# Altium schematic sheet Sheet1hh.SchDoc
size A4; SheetNumber: 1; SheetTotal: 1
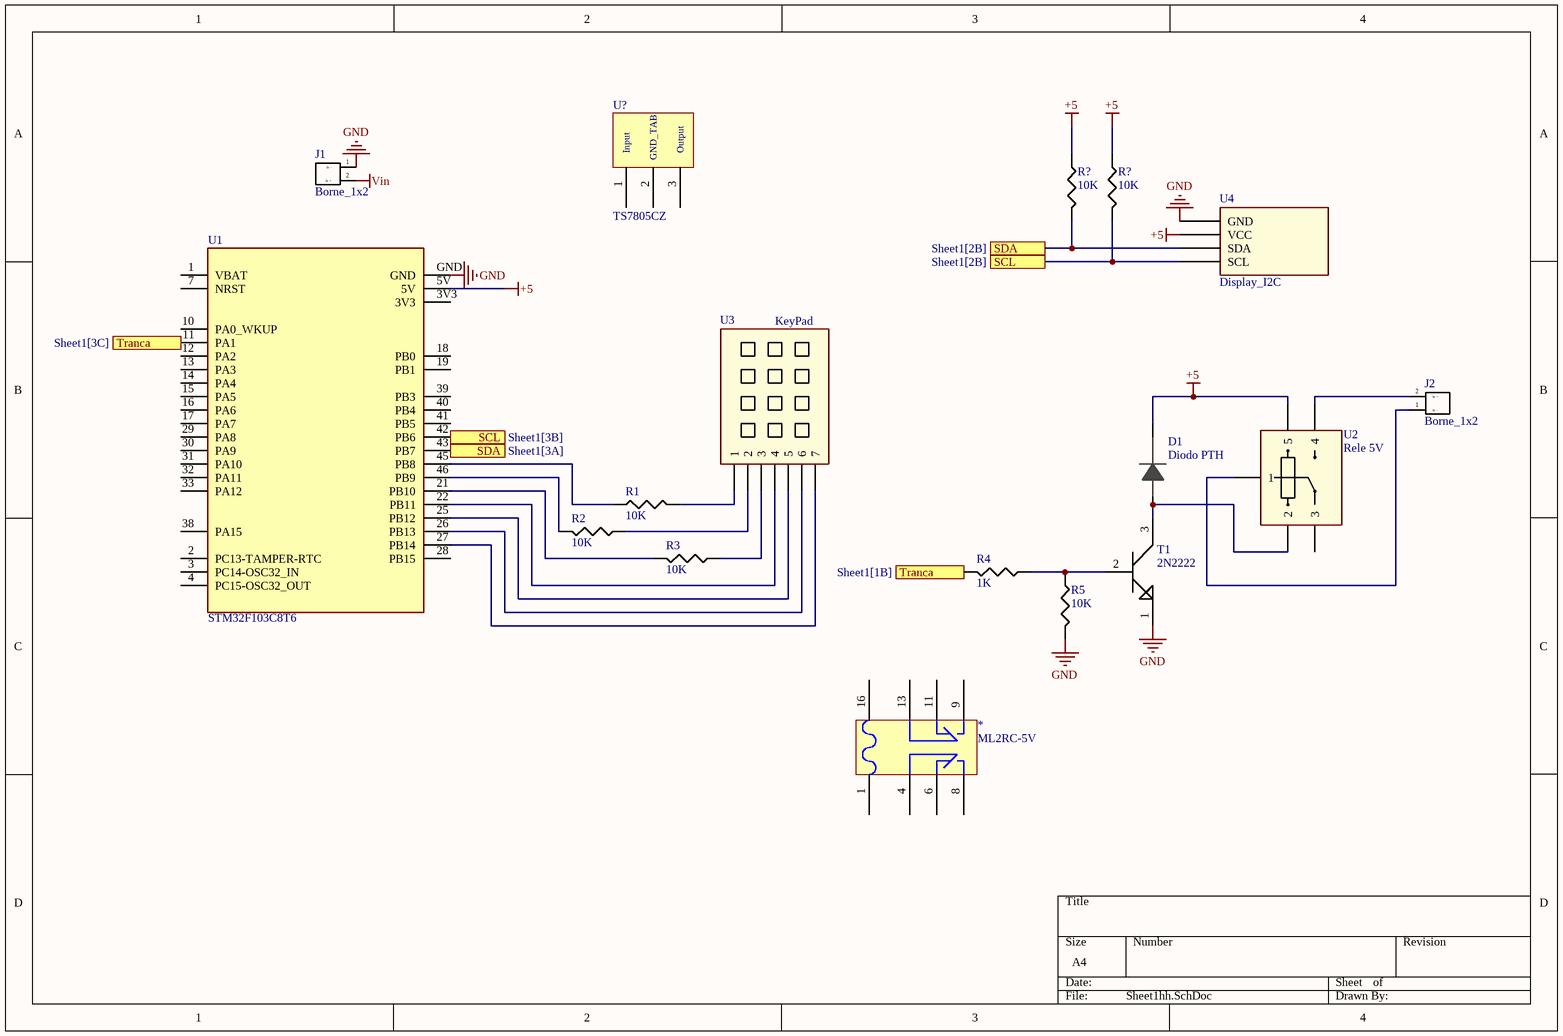
[diagram p0: Sheet1hh.SchDoc]

## Parts
(Parts that share a designator on the sheet are numbered #1, #2 ... from top to bottom, then left to right.)
*  ML2RC-5V  [ML2RC-5V]
D1  Diodo PTH  [DIODO]
J1  Borne_1x2  [Borne1x2]
J2  Borne_1x2  [Borne1x2]
R1  10K  [R_PTH]
R2  10K  [R_PTH]
R3  10K  [R_PTH]
R4  1K  [R_PTH]
R5  10K  [R_PTH]
R?#1  10K  [R_PTH]
R?#2  10K  [R_PTH]
T1  2N2222  [2N2222]
U1  STM32F103C8T6  [STM32]
U2  Rele 5V  [Rele]
U3  KeyPad  [KeyPad]
U4  Display_I2C  [LCD_I2C]
U?  TS7805CZ

## Ports
SCL (see Sheet1[2B]), SCL (see Sheet1[3B]), SDA (see Sheet1[2B]), SDA (see Sheet1[3A]), Tranca (see Sheet1[1B]), Tranca (see Sheet1[3C])

## Nets
+5: D1.1 R?#1.1 R?#2.1 U1.5V U2.5 U4.2(VCC)
GND: J1.1(In_-) R5.2 T1.1 U1.GND U4.1(GND)
Vin: J1.2(In_+)
SCL: R?#2.2 U1.42(PB6) U4.4(SCL) ; port SCL
SDA: R?#1.2 U1.43(PB7) U4.3(SDA) ; port SDA
Tranca: R4.2 U1.11(PA1) ; port Tranca
NetD1_2: D1.2 T1.3 U2.2
NetJ2_1: J2.1(In_-) U2.1
NetJ2_2: J2.2(In_+) U2.4
NetR1_1: R1.1 U1.45(PB8)
NetR1_2: R1.2 U3.1
NetR2_1: R2.1 U3.2
NetR2_2: R2.2 U1.46(PB9)
NetR3_1: R3.1 U3.3
NetR3_2: R3.2 U1.21(PB10)
NetR4_1: R4.1 R5.1 T1.2
NetU1_22: U1.22(PB11) U3.4
NetU1_25: U1.25(PB12) U3.5
NetU1_26: U1.26(PB13) U3.6
NetU1_27: U1.27(PB14) U3.7

Not connected (* = marked no-connect by the designer): * 1 4 6 8 9 11 13 16; U1 1(VBAT) 2(PC13-TAMPER-RTC) 3(PC14-OSC32_IN) 3V3 4(PC15-OSC32_OUT) 7(NRST) 10(PA0_WKUP) 12(PA2) 13(PA3) 14(PA4) 15(PA5) 16(PA6) 17(PA7) 18(PB0) 19(PB1) 28(PB15) 29(PA8) 30(PA9) 31(PA10) 32(PA11) 33(PA12) 38(PA15) 39(PB3) 40(PB4) 41(PB5); U2 3; U? 1 2 3

## Notes on the sheet
- (in symbol TS7805CZ) Input; Output; GND_TAB

## Library data of the parts
* = ML2RC-5V: Relê 2 contatos reversíveis bifurcados
D1 = Diodo
R1-R5 R?#1 R?#2 = R_PTH_10k
U1 = STM32F103C8T6: ARM® Cortex®-M3 STM32F1 Microcontroller IC 32-Bit 72MHz 64KB (64K x 8) FLASH 48-LQFP (7x7); MF: STMicroelectronics; SnapEDA_Link: https://www.snapeda.com/parts/STM32F103C8T6/STMicroelectronics/view-part/?ref=snap; Package: LQFP-48 STMicroelectronics; Value: *; MP: STM32F103C8T6; Check_prices: https://www.snapeda.com/parts/STM32F103C8T6/STMicroelectronics/view-part/?ref=eda
U2 = Rele
U? = TS7805CZ: Linear Voltage Regulator, Fixed, Positive Output, 35 V, 5 V, 1.5 A, 3 Pins, TO-220; Manufacturer: STMicroelectronics; Manufacturer Part Number: L7805CV; Dropout Voltage: 2V; Max Supply Voltage: 25V; Max Junction Temperature (Tj): 125°C; Max Output current: 1.5A; Min Input Voltage: 7V; Min Output Voltage: 4.65V; Nominal Output Voltage: 5V; Number of Channels: 1; Power Supply Rejection Ratio (PSRR): 62dB; Quiescent Current: 8mA; Tolerance: 5%; Supplier: Avnet; Supplier Part Number: L7805CV; RoHS: Compliant; Category: Voltage Regulators - Linear; Stock: 15085; Pricing: 1=0,41797, 2=0,2691, 4=0,26772, 8=0,26634, 16=0,16896 (USD); Case/Package: TO-220; China RoHS: Non-Compliant; Contact Plating: Gold; Height: 9.15mm; Height - Seated (Max): 19.68mm; Lead Free: Lead Free; Length: 10.2mm; Lifecycle Status: Production; Max Operating Temperature: 125°C; Min Operating Temperature: -40°C; Mounting Technology: Through Hole; Number of Circuits: 1; Number of Outputs: 1; Pins: 3; Number of Regulators: 1; Number of Terminals: 3; Output Current: 1.5A; Output Type: Fixed; Output Voltage: 5V; Polarity: Positive; Radiation Hardening: No; REACH SVHC: No; Schedule B: 8542390000, 8542390000|8542390000|8542390000|8542390000|8542390000|8542390000|8542390000|8542390000|8542390000|8542390000|8542390000|8542390000|8542390000|8542390000|8542390000|8542390000|8542390000|8542390000|8542390000|8542390000|8542390000, 8542390000|8542390000|8542390000|8542390000|8542390000|8542390000|8542390000|8542390000|8542390000|8542390000|8542390000|8542390000|8542390000|8542390000|8542390000|8542390000|8542390000|8542390000|8542390000|8542390000|8542390000|8542390000, 8542390000|8542390000|8542390000|8542390000|8542390000|8542390000|8542390000|8542390000|8542390000|8542390000|8542390000|8542390000|8542390000|8542390000|8542390000|8542390000|8542390000|8542390000|8542390000|8542390000|8542390000|8542390000|8542390000; Terminal Pitch: 2.54mm; Voltage Tolerance: 5%; Weight: 2.299997g; Width: 4.5mm; ComponentLink1URL: https://datasheet.octopart.com:443/L7805CV-STMicroelectronics-datasheet-136036604.pdf?src-supplier=ODG+(Origin+Data+Global); ComponentLink1Description: https://datasheet.octopart.com:443/L7805CV-STMicroelectronics-datasheet-136036604.pdf?src-supplier=ODG+(Origin+Data+Global); ComponentLink2URL: https://datasheet.octopart.com:443/L7805CV-STMicroelectronics-datasheet-73860655.pdf?src-supplier=Farnell; ComponentLink2Description: https://datasheet.octopart.com:443/L7805CV-STMicroelectronics-datasheet-73860655.pdf?src-supplier=Farnell; ComponentLink3URL: https://datasheet.octopart.com:443/L7805CV-STMicroelectronics-datasheet-14717135.pdf?src-supplier=Farnell; ComponentLink3Description: https://datasheet.octopart.com:443/L7805CV-STMicroelectronics-datasheet-14717135.pdf?src-supplier=Farnell; ComponentLink4URL: https://datasheet.octopart.com:443/L7805CV-STMicroelectronics-datasheet-108470.pdf?src-supplier=Farnell; ComponentLink4Description: https://datasheet.octopart.com:443/L7805CV-STMicroelectronics-datasheet-108470.pdf?src-supplier=Farnell; ComponentLink5URL: https://datasheet.octopart.com:443/L7805CV-STMicroelectronics-datasheet-25360458.pdf?src-supplier=element14+APAC; ComponentLink5Description: https://datasheet.octopart.com:443/L7805CV-STMicroelectronics-datasheet-25360458.pdf?src-supplier=element14+APAC; ComponentLink6URL: https://datasheet.octopart.com:443/L7805CV-STMicroelectronics-datasheet-62333080.pdf?src-supplier=element14+APAC; ComponentLink6Description: https://datasheet.octopart.com:443/L7805CV-STMicroelectronics-datasheet-62333080.pdf?src-supplier=element14+APAC; ComponentLink7URL: https://datasheet.octopart.com:443/L7805CV-STMicroelectronics-datasheet-5316848.pdf?src-supplier=Factory+Futures; ComponentLink7Description: https://datasheet.octopart.com:443/L7805CV-STMicroelectronics-datasheet-5316848.pdf?src-supplier=Factory+Futures; ComponentLink8URL: https://datasheet.octopart.com:443/L7805CV-STMicroelectronics-datasheet-11003276.pdf?src-supplier=Factory+Futures; ComponentLink8Description: https://datasheet.octopart.com:443/L7805CV-STMicroelectronics-datasheet-11003276.pdf?src-supplier=Factory+Futures; ComponentLink9URL: https://datasheet.octopart.com:443/L7805CV-STMicroelectronics-datasheet-12510217.pdf?src-supplier=Factory+Futures; ComponentLink9Description: https://datasheet.octopart.com:443/L7805CV-STMicroelectronics-datasheet-12510217.pdf?src-supplier=Factory+Futures; ComponentLink10URL: https://datasheet.octopart.com:443/L7805CV-STMicroelectronics-datasheet-10835933.pdf?src-supplier=Factory+Futures; ComponentLink10Description: https://datasheet.octopart.com:443/L7805CV-STMicroelectronics-datasheet-10835933.pdf?src-supplier=Factory+Futures; ComponentLink11URL: https://datasheet.octopart.com:443/L7805CV-STMicroelectronics-datasheet-10550045.pdf?src-supplier=Factory+Futures; ComponentLink11Description: https://datasheet.octopart.com:443/L7805CV-STMicroelectronics-datasheet-10550045.pdf?src-supplier=Factory+Futures; ComponentLink12URL: https://datasheet.octopart.com:443/L7805CV-STMicroelectronics-datasheet-10406743.pdf?src-supplier=Factory+Futures; ComponentLink12Description: https://datasheet.octopart.com:443/L7805CV-STMicroelectronics-datasheet-10406743.pdf?src-supplier=Factory+Futures; ComponentLink13URL: https://datasheet.octopart.com:443/L7805CV-STMicroelectronics-datasheet-10082731.pdf?src-supplier=Factory+Futures; ComponentLink13Description: https://datasheet.octopart.com:443/L7805CV-STMicroelectronics-datasheet-10082731.pdf?src-supplier=Factory+Futures; ComponentLink14URL: https://datasheet.octopart.com:443/L7805CV-STMicroelectronics-datasheet-180738849.pdf?src-supplier=IHS; ComponentLink14Description: https://datasheet.octopart.com:443/L7805CV-STMicroelectronics-datasheet-180738849.pdf?src-supplier=IHS; ComponentLink15URL: https://datasheet.octopart.com:443/L7805CV-STMicroelectronics-datasheet-62333152.pdf?src-supplier=STMicroelectronics; ComponentLink15Description: https://datasheet.octopart.com:443/L7805CV-STMicroelectronics-datasheet-62333152.pdf?src-supplier=STMicroelectronics; ComponentLink16URL: https://datasheet.octopart.com:443/L7805C-V-STMicroelectronics-datasheet-8494008.pdf?src-supplier=Future+Electronics; ComponentLink16Description: https://datasheet.octopart.com:443/L7805C-V-STMicroelectronics-datasheet-8494008.pdf?src-supplier=Future+Electronics; ComponentLink17URL: https://datasheet.octopart.com:443/L7805CV-STMicroelectronics-datasheet-8464528.pdf?src-supplier=Future+Electronics; ComponentLink17Description: https://datasheet.octopart.com:443/L7805CV-STMicroelectronics-datasheet-8464528.pdf?src-supplier=Future+Electronics; ComponentLink18URL: https://datasheet.octopart.com:443/L7805CV-STMicroelectronics-datasheet-109553.pdf?src-supplier=element14; ComponentLink18Description: https://datasheet.octopart.com:443/L7805CV-STMicroelectronics-datasheet-109553.pdf?src-supplier=element14; ComponentLink19URL: https://datasheet.octopart.com:443/L7805CV-STMicroelectronics-datasheet-5578.pdf?src-supplier=Newark; ComponentLink19Description: https://datasheet.octopart.com:443/L7805CV-STMicroelectronics-datasheet-5578.pdf?src-supplier=Newark; ComponentLink20URL: https://datasheet.octopart.com:443/L7805CV-STMicroelectronics-datasheet-61038.pdf?src-supplier=SOS+electronic; ComponentLink20Description: https://datasheet.octopart.com:443/L7805CV-STMicroelectronics-datasheet-61038.pdf?src-supplier=SOS+electronic; ComponentLink21URL: https://datasheet.octopart.com:443/L7805CV-STMicroelectronics-datasheet-14169698.pdf?src-supplier=iiiC; ComponentLink21Description: https://datasheet.octopart.com:443/L7805CV-STMicroelectronics-datasheet-14169698.pdf?src-supplier=iiiC; ComponentLink22URL: https://datasheet.octopart.com:443/L7805CV-STMicroelectronics-datasheet-11554490.pdf?src-supplier=Arrow+Electronics; ComponentLink22Description: https://datasheet.octopart.com:443/L7805CV-STMicroelectronics-datasheet-11554490.pdf?src-supplier=Arrow+Electronics; ComponentLink23URL: https://datasheet.octopart.com:443/L7805CV-STMicroelectronics-datasheet-9642343.pdf?src-supplier=RS+(Formerly+Allied+Electronics); ComponentLink23Description: https://datasheet.octopart.com:443/L7805CV-STMicroelectronics-datasheet-9642343.pdf?src-supplier=RS+(Formerly+Allied+Electronics); ComponentLink24URL: https://datasheet.octopart.com:443/L7805CV-STMicroelectronics-datasheet-7264666.pdf?src-supplier=Jameco; ComponentLink24Description: https://datasheet.octopart.com:443/L7805CV-STMicroelectronics-datasheet-7264666.pdf?src-supplier=Jameco; ComponentLink25URL: https://datasheet.octopart.com:443/L7805CV-STMicroelectronics-datasheet-154404753.pdf?src-supplier=Jameco; ComponentLink25Description: https://datasheet.octopart.com:443/L7805CV-STMicroelectronics-datasheet-154404753.pdf?src-supplier=Jameco